# EAGLE schematic tempix__main_board (EAGLE 7.2.0)

## Sheet 1 of 3
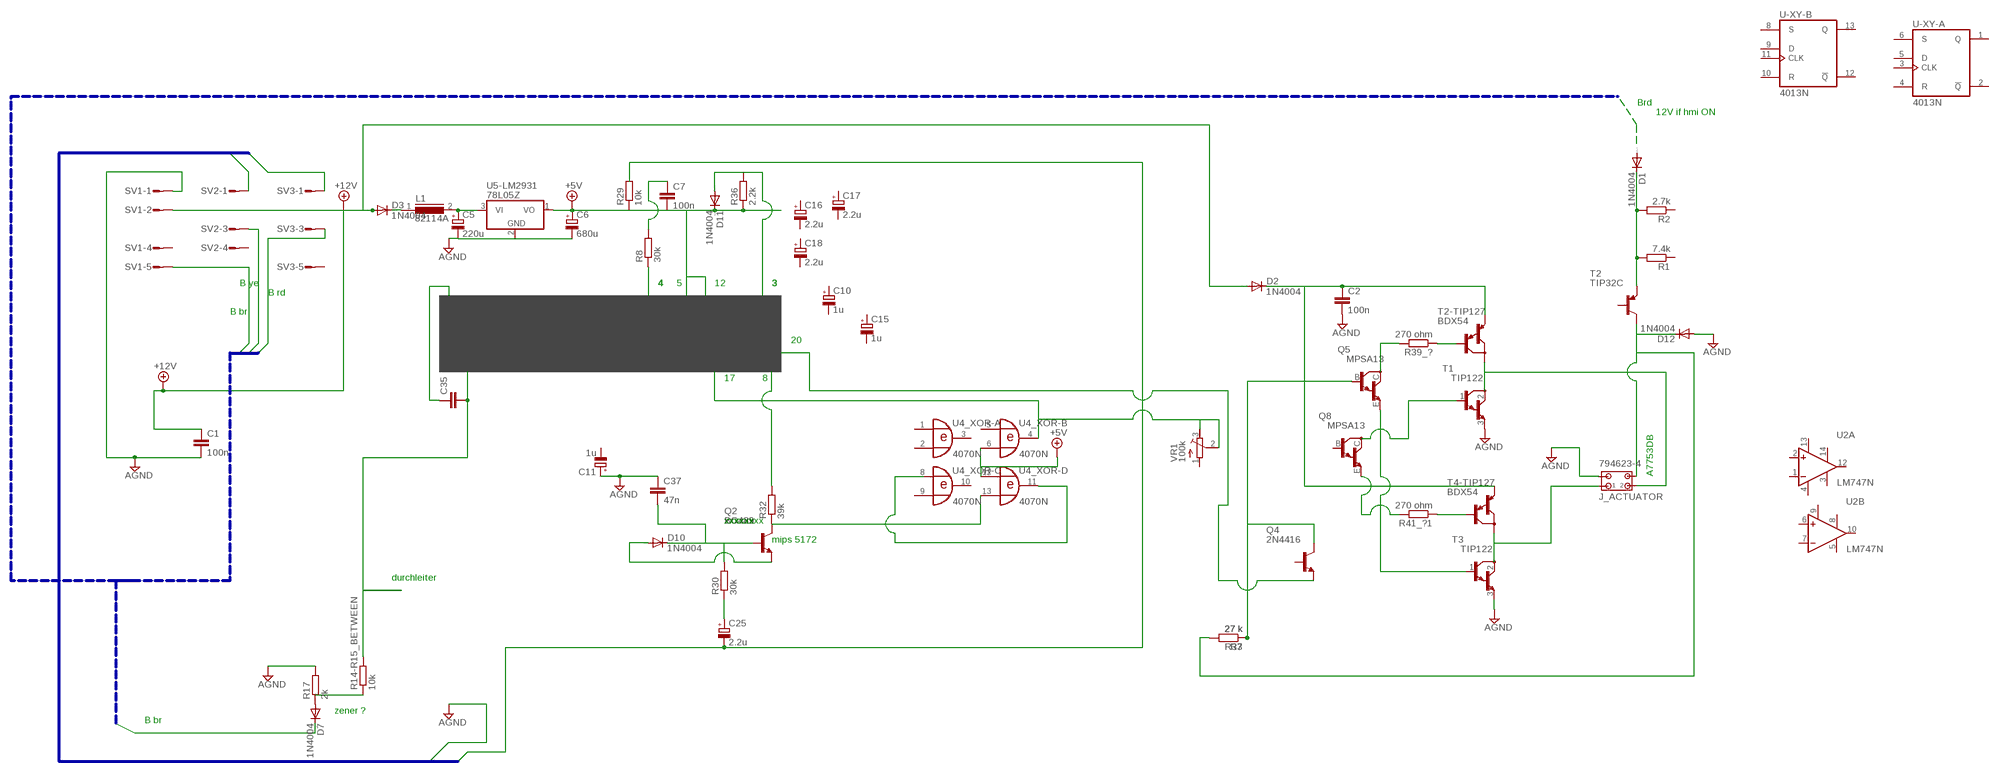
[diagram p0: schematic, sheet 1]

### Parts
C1  100n  C-EU025-060X050  [C025-060X050]
C2  100n  C-EU025-060X050  [C025-060X050]
C5  220u  CPOL-EUTT2D4  [TT2D4]
C6  680u  CPOL-EUTT2D4  [TT2D4]
C7  100n  C-EU025-060X050  [C025-060X050]
C10  1u  CPOL-EUTT2D4  [TT2D4]
C11  1u  CPOL-EUTT2D4  [TT2D4]
C15  1u  CPOL-EUTT2D4  [TT2D4]
C16  2.2u  CPOL-EUTT2D4  [TT2D4]
C17  2.2u  CPOL-EUTT2D4  [TT2D4]
C18  2.2u  CPOL-EUTT2D4  [TT2D4]
C25  2.2u  CPOL-EUTT2D4  [TT2D4]
C35  C-EU025_050-045X075  [C025_050-045X075]
C37  47n  C-EU025-060X050  [C025-060X050]
D1  1N4004  [DO41-10]
D2  1N4004  [DO41-10]
D3  1N4004  [DO41-10]
D7  1N4004  [DO41-10]
D10  1N4004  [DO41-10]
D11  1N4004  [DO41-10]
D12  1N4004  [DO41-10]
J_ACTUATOR  794623-4  [794623-4]
L1  82114A  [82114A]
Q2  BC489  [TO92-EBC]
Q4  2N4416  [TO92]
Q5  MPSA13  MMBTA13LT1-NPN_DARL-SOT23-BEC  [SOT23-BEC]
Q8  MPSA13  MMBTA13LT1-NPN_DARL-SOT23-BEC  [SOT23-BEC]
R1  7.4k  R-EU_0204/2V  [0204V]
R2  2.7k  R-EU_0204/2V  [0204V]
R3  27 k  R-EU_0204/2V  [0204V]
R8  30k  R-EU_0204/2V  [0204V]
R14-R15_BETWEEN  10k  R-EU_0204/2V  [0204V]
R17  2k  R-EU_0204/2V  [0204V]
R29  10k  R-EU_0204/2V  [0204V]
R30  30k  R-EU_0204/2V  [0204V]
R32  39k  R-EU_0204/2V  [0204V]
R36  2.2k  R-EU_0204/2V  [0204V]
R37  27 k  R-EU_0204/2V  [0204V]
R39_?  270 ohm  R-EU_0204/2V  [0204V]
R41_?1  270 ohm  R-EU_0204/2V  [0204V]
SV1  L05P  [L05P]
SV2  L05P  [L05P]
SV3  L05P  [L05P]
T1  TIP122  [TO220]
T2  TIP32C  [TO220]
T2-TIP127  BDX54  [TO220]
T3  TIP122  [TO220]
T4-TIP127  BDX54  [TO220]
U2  LM747N  [DIL14]
U4_XOR-  4070N  [DIL14]
U5-LM2931  78L05Z  [TO92]
U-XY-  4013N  [DIL14]
VR1  100k  R-TRIMM3202  [RTRIM3202]

### Nets
+5V: D11.C R36.1 U4_XOR-.6(B:I1) U4_XOR-.12(D:I0) U5-LM2931.1(VO)
+12V: C1.1 D2.A D3.A SV1.2 ; also sheet 2
AGND: C1.2 C2.2 C5.- C6.- C11.+ C37.1 D12.A J_ACTUATOR.3 R17.2 SV1.1 T1.3(E) T3.3(E) U5-LM2931.2(GND)
N$1: C25.-
N$2: D3.C L1.1
N$3: C5.+ L1.2 U5-LM2931.3(VI)
N$4: R39_?.1 T2-TIP127.1(B)
N$5: C7.1 R8.2
N$6: R8.1
N$7: D11.A R36.2
N$8: SV2.3
N$18: SV2.1
N$19: SV1.5
N$20: SV3.3
N$21: D7.C
N$22: D7.A R17.1
N$23: R14-R15_BETWEEN.1
N$24: C35.1
N$25: C35.2 R14-R15_BETWEEN.2
N$26: SV3.1
N$27: C25.+ R30.1
N$28: C37.2 D10.C Q2.B R30.2
N$29: D10.A Q2.E
N$30: Q2.C R32.1 U4_XOR-.13(D:I1)
N$31: C2.1 D2.C T2-TIP127.3(E) T4-TIP127.3(E)
N$32: U4_XOR-.4(B:O) VR1.2(S) VR1.3(E)
N$33: D1.C R1.2 R2.2 T2.3(E)
N$34: J_ACTUATOR.1 T3.2(C) T4-TIP127.2(C)
N$35: J_ACTUATOR.2 T1.2(C) T2-TIP127.2(C)
N$36: Q4.3(E)
N$38: R32.2
N$39: U4_XOR-.11(D:O)
N$40: Q5.C R39_?.2
N$41: Q5.E T3.1(B)
N$42: R41_?1.1 T4-TIP127.1(B)
N$43: Q8.E R41_?1.2
N$44: Q8.C T1.1(B)
N$45: Q4.1(C) Q5.B R3.1 R37.1
N$46: D12.C J_ACTUATOR.4 R3.2 R37.2 T2.2(C)
Unconnected: C6.+ C7.2 C10.+ C10.- C11.- C15.+ C15.- C16.+ C16.- C17.+ C17.- C18.+ C18.- D1.A Q4.2(B) Q8.B R1.1 R2.1 R29.1 R29.2 SV1.3 SV1.4 SV2.2 SV2.4 SV2.5 SV3.2 SV3.4 SV3.5 T2.1(B) U2.1(A:-IN) U2.2(A:+IN) U2.3(A:NULL1) U2.5(B:NULL1) U2.6(B:+IN) U2.7(B:-IN) U2.8(B:NULL2) U2.10(B:OUT) U2.12(A:OUT) U2.14(A:NULL2) U4_XOR-.1(A:I0) U4_XOR-.2(A:I1) U4_XOR-.3(A:O) U4_XOR-.5(B:I0) U4_XOR-.8(C:I0) U4_XOR-.9(C:I1) U4_XOR-.10(C:O) U-XY-.1(A:Q) U-XY-.2(A:!Q) U-XY-.3(A:CLK) U-XY-.4(A:R) U-XY-.5(A:D) U-XY-.6(A:S) U-XY-.8(B:S) U-XY-.9(B:D) U-XY-.10(B:R) U-XY-.11(B:CLK) U-XY-.12(B:!Q) U-XY-.13(B:Q) VR1.1(A)

### Buses
B$1
B$2

### Notes on the sheet
- Brd
- 12V if hmi ON
- B ye | 4 | 4 | 5 | 12 | 3 | 3
- B rd
- B br
- 20
- 17 | 8
- A7753DB
- xxxxxx | xxxxxx | xxxxxx | xxxxxx
- mips 5172
- durchleiter
- zener ?
- B br

## Sheet 2 of 3
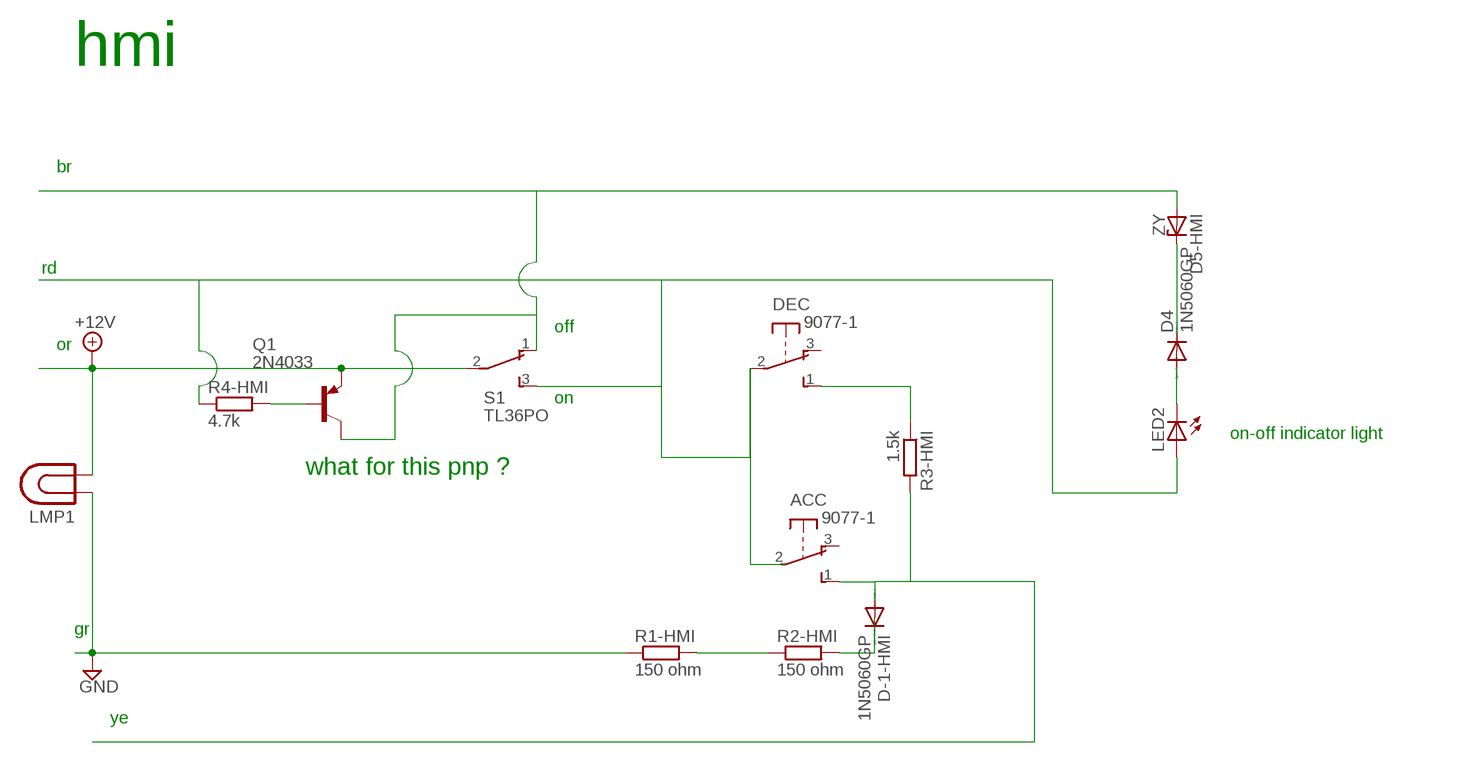
[diagram p1: schematic, sheet 2]

### Parts
ACC  9077-1  [9077-1]
D4  1N5060GP  [DO15-12]
D5-HMI  ZY  [P1Z12]
D-1-HMI  1N5060GP  [DO15-12]
DEC  9077-1  [9077-1]
LED2  LEDLD260  [LD260]
LMP1  LAMP  [LDH-5R]
Q1  2N4033  [TO39]
R1-HMI  150 ohm  R-EU_0207/7  [0207/7]
R2-HMI  150 ohm  R-EU_0207/7  [0207/7]
R3-HMI  1.5k  R-EU_0207/7  [0207/7]
R4-HMI  4.7k  R-EU_0207/7  [0207/7]
S1  TL36PO  [TL3XPO]

### Nets
+12V: LMP1.2 Q1.1(E) S1.2(P) ; also sheet 1
GND: LMP1.1 R1-HMI.1
N$9: D-1-HMI.C R2-HMI.2
N$10: ACC.2(P) DEC.2(P) LED2.A R4-HMI.1 S1.3(S)
N$11: DEC.1(S) R3-HMI.1
N$12: ACC.1(S) D-1-HMI.A R3-HMI.2
N$13: R1-HMI.2 R2-HMI.1
N$14: D4.A LED2.K(C)
N$15: D4.C D5-HMI.C
N$16: Q1.2(B) R4-HMI.2
N$17: D5-HMI.A Q1.3(C) S1.1(O)
Unconnected: ACC.3(O) DEC.3(O)

### Notes on the sheet
- hmi
- br
- rd
- off
- or
- on
- on-off indicator light
- what for this pnp ?
- gr
- ye

## Sheet 3 of 3

## Power pins joined to a net without a drawn wire
V+: U2.9(B:V+) U2.13(A:V+)
V-: U2.4(P:V-)
VDD: U4_XOR-.14(P:VDD) U-XY-.14(P:VDD)
VSS: U4_XOR-.7(P:VSS) U-XY-.7(P:VSS)

## Library data of the parts
ACC DEC = switch-misc:9077-1: MARQUARDT SWITCH 9077.0100 Distributor: Buerklin <https://www.buerklin.com/default.asp?event=ShowArtikel%2812G2820%29&l=d&jump=ArtNr_12G2820>
C1 C2 C7 C35 C37 = resistor:C-EU: CAPACITOR, European symbol
C5 C6 C10 C11 C15-C18 C25 = resistor:CPOL-EU: POLARIZED CAPACITOR, European symbol
D1-D3 D7 D10-D12 = diode:1N4004: DIODE general purpose rectifier, 1 A
D4 D-1-HMI = diode:1N5060GP: DIODE controlled avalanche rectifier
D5-HMI = diode:ZY: Z DIODE
J_ACTUATOR = con-amp:794623-4: MICRO MATE N LOK Dual Row, grid 1.5 mm Source: http://catalog.tycoelectronics.com .. ENG_CD_794623_F.pdf
L1 = inductors:82114A: INDUCTOR
LED2 = led:LED: LED OSRAM: - CHIPLED LG R971, LG N971, LY N971, LG Q971, LY Q971, LO R971, LY R971 LH N974, LH R974 LS Q976, LO Q976, LY Q976 LO Q996 - Hyper CHIPLED LW Q18S LB Q993, LB Q99A, LB R99A - SideLED LS A670, LO A670, LY A670, LG A670, LP A670 LB A673, LV A673, LT A673, LW A673 LH A674 LY A675 LS A676, LA A676, LO A676, LY A676, LW A676 LS A679, LY A679, LG A679 - Hyper Micro SIDELED® LS Y876, LA Y876, LO Y876, LY Y876 LT Y87S - SmartLED LW L88C, LW L88S LB L89C, LB L89S, LG L890 LS L89K, LO L89K, LY L89K LS L896, LA L896, LO L896, LY L896 - TOPLED LS T670, LO T670, LY T670, LG T670, LP T670 LSG T670, LSP T670, LSY T670, LOP T670, LYG T670 LG T671, LOG T671, LSG T671 LB T673, LV T673, LT T673, LW T673 LH T674 LS T676, LA T676, LO T676, LY T676, LB T676, LH T676, LSB T676, LW T676 LB T67C, LV T67C, LT T67C, LS T67K, LO T67K, LY T67K, LW E67C LS E67B, LA E67B, LO E67B, LY E67B, LB E67C, LV E67C, LT E67C LW T67C LS T679, LY T679, LG T679 LS T770, LO T770, LY T770, LG T770, LP T770 LB T773, LV T773, LT T773, LW T773 LH T774 LS E675, LA E675, LY E675, LS T675 LS T776, LA T776, LO T776, LY T776, LB T776 LHGB T686 LT T68C, LB T68C - Hyper Mini TOPLED® LB M676 - Mini TOPLED Santana® LG M470 LS M47K, LO M47K, LY M47K Source: http://www.osram.convergy.de LUXEON: - LUMILED® LXK2-PW12-R00, LXK2-PW12-S00, LXK2-PW14-U00, LXK2-PW14-V00 LXK2-PM12-R00, LXK2-PM12-S00, LXK2-PM14-U00 LXK2-PE12-Q00, LXK2-PE12-R00, LXK2-PE12-S00, LXK2-PE14-T00, LXK2-PE14-U00 LXK2-PB12-K00, LXK2-PB12-L00, LXK2-PB12-M00, LXK2-PB14-N00, LXK2-PB14-P00, LXK2-PB14-Q00 LXK2-PR12-L00, LXK2-PR12-M00, LXK2-PR14-Q00, LXK2-PR14-R00 LXK2-PD12-Q00, LXK2-PD12-R00, LXK2-PD12-S00 LXK2-PH12-R00, LXK2-PH12-S00 LXK2-PL12-P00, LXK2-PL12-Q00, LXK2-PL12-R00 Source: www.luxeon.com KINGBRIGHT: KA-3528ASYC Source: www.kingbright.com
LMP1 = special:LAMP: LED HOLDER
Q1 = transistor-pnp:2N4033*: PNP Transistror
Q2 = transistor-npn:BC489*: NPN Transistor
Q4 = transistor-npn:2N4416: NPN Transistor
Q5 Q8 = transistor:*-NPN_DARL-: NPN Darlington Transistor
R1 R1-HMI R2 R2-HMI R3 R3-HMI R4-HMI R8 R14-R15_BETWEEN R17 R29 R30 R32 R36 R37 R39_? R41_?1 = resistor:R-EU_: RESISTOR, European symbol
S1 = switch:TL36PO: TINY SWITCH ON - ON Source: http://www2.produktinfo.conrad.com/datenblaetter/700000-724999/705152-da-01-de-Subminiaturschalter_TL_36YO.pdf
SV1-SV3 = con-amp-mt:L05P: AMP MT CONNECTOR; OC_FARNELL: unknown; OC_NEWARK: unknown
T1 T3 = transistor:TIP122: NPN BIPOLAR DARLINGTON TRANSISTOR
T2 = transistor:TIP32: PNP Transistor Medium Power Linear Switching Applications Source: http://onsemi.com
T2-TIP127 T4-TIP127 = transistor:BDX54: PNP BIPOLAR DARLINGTON TRANSISTOR Source: http://www.datasheetcatalog.org/datasheet/mospec/BDX54.pdf
U2 = linear:LM747*: Dual Operational Amplifier Source: http://cache.national.com/ds/LM/LM747.pdf
U4_XOR- = 40xx:4070: Quad 2-input XOR
U5-LM2931 = linear:78*: Positive VOLTAGE REGULATOR Source: http://cache.national.com/ds/LM/LM78L05.pdf http://www.fairchildsemi.com/ds/LM/LM7805.pdf
U-XY- = 40xx:4013: Dual D FLIP FLOP, set/reset
VR1 = resistor:R-TRIMM: Trimm resistor